# EAGLE design eib-64-large (EAGLE 9.6.2)
DESIGNER: JON NEWMAN; DESIGN_NAME: EIB-64-LARGE; LICENSE: CERN OHL v1.2; REVISION: 1.1
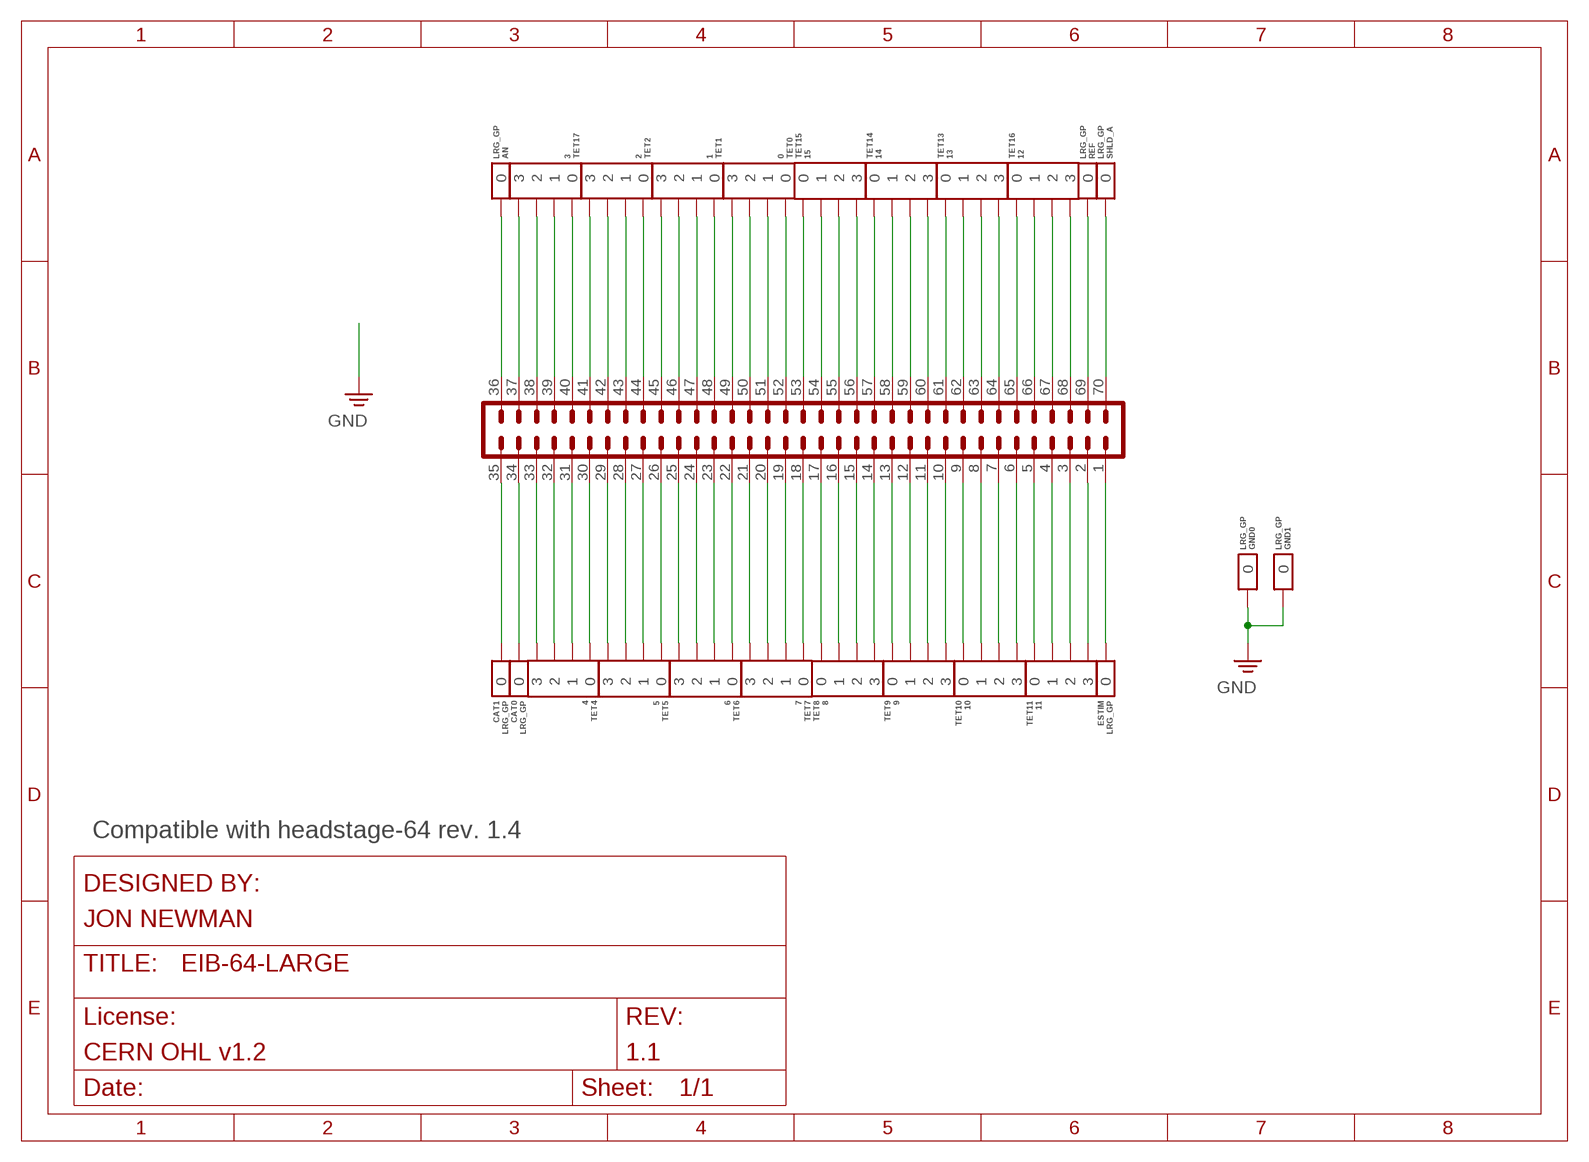
[diagram p0: schematic, sheet 1]

## Parts
AN  LRG_GP  GOLDPIN_0.5ID_0.7OD  [GOLDPIN_0.5ID_0.7OD]
CAT0  LRG_GP  GOLDPIN_0.5ID_0.7OD  [GOLDPIN_0.5ID_0.7OD]
CAT1  LRG_GP  GOLDPIN_0.5ID_0.7OD  [GOLDPIN_0.5ID_0.7OD]
ESTIM  LRG_GP  GOLDPIN_0.5ID_0.7OD  [GOLDPIN_0.5ID_0.7OD]
GND0  LRG_GP  GOLDPIN_0.5ID_0.7OD  [GOLDPIN_0.5ID_0.7OD]
GND1  LRG_GP  GOLDPIN_0.5ID_0.7OD  [GOLDPIN_0.5ID_0.7OD]
J1  DF40-REC  PINHD-2X35_DF40REF-LRG  [DDF40-70REC-LRG]
REF  LRG_GP  GOLDPIN_0.5ID_0.7OD  [GOLDPIN_0.5ID_0.7OD]
SHLD_A  LRG_GP  GOLDPIN_0.5ID_0.7OD  [GOLDPIN_0.5ID_0.7OD]
TET0  0  TETRODE_128_0.5ID_0.7OD  [TETRODE_128_0.5ID_0.7OD]
TET1  1  TETRODE_128_0.5ID_0.7OD  [TETRODE_128_0.5ID_0.7OD]
TET2  2  TETRODE_128_0.5ID_0.7OD  [TETRODE_128_0.5ID_0.7OD]
TET4  4  TETRODE_128_0.5ID_0.7OD  [TETRODE_128_0.5ID_0.7OD]
TET5  5  TETRODE_128_0.5ID_0.7OD  [TETRODE_128_0.5ID_0.7OD]
TET6  6  TETRODE_128_0.5ID_0.7OD  [TETRODE_128_0.5ID_0.7OD]
TET7  7  TETRODE_128_0.5ID_0.7OD  [TETRODE_128_0.5ID_0.7OD]
TET8  8  TETRODE_128_0.5ID_0.7OD  [TETRODE_128_0.5ID_0.7OD]
TET9  9  TETRODE_128_0.5ID_0.7OD  [TETRODE_128_0.5ID_0.7OD]
TET10  10  TETRODE_128_0.5ID_0.7OD  [TETRODE_128_0.5ID_0.7OD]
TET11  11  TETRODE_128_0.5ID_0.7OD  [TETRODE_128_0.5ID_0.7OD]
TET13  13  TETRODE_128_0.5ID_0.7OD  [TETRODE_128_0.5ID_0.7OD]
TET14  14  TETRODE_128_0.5ID_0.7OD  [TETRODE_128_0.5ID_0.7OD]
TET15  15  TETRODE_128_0.5ID_0.7OD  [TETRODE_128_0.5ID_0.7OD]
TET16  12  TETRODE_128_0.5ID_0.7OD  [TETRODE_128_0.5ID_0.7OD]
TET17  3  TETRODE_128_0.5ID_0.7OD  [TETRODE_128_0.5ID_0.7OD]

## Nets
CAT0: CAT0.P$1 J1.34
CAT1: CAT1.P$1 J1.35
ESTIM: ESTIM.P$1 J1.1
GND: GND0.P$1 GND1.P$1
N$1: AN.P$1 J1.36
N$2: J1.69 REF.P$1
N$3: J1.70 SHLD_A.P$1
N$4: J1.51 TET0.1
N$5: J1.52 TET0.0
N$6: J1.50 TET0.2
N$7: J1.49 TET0.3
N$8: J1.47 TET1.1
N$9: J1.48 TET1.0
N$10: J1.46 TET1.2
N$11: J1.45 TET1.3
N$12: J1.43 TET2.1
N$13: J1.44 TET2.0
N$14: J1.42 TET2.2
N$15: J1.41 TET2.3
N$16: J1.62 TET13.1
N$17: J1.61 TET13.0
N$18: J1.63 TET13.2
N$19: J1.64 TET13.3
N$20: J1.58 TET14.1
N$21: J1.57 TET14.0
N$22: J1.59 TET14.2
N$23: J1.60 TET14.3
N$24: J1.54 TET15.1
N$25: J1.53 TET15.0
N$26: J1.55 TET15.2
N$27: J1.56 TET15.3
N$28: J1.66 TET16.1
N$29: J1.65 TET16.0
N$30: J1.67 TET16.2
N$31: J1.68 TET16.3
N$32: J1.39 TET17.1
N$33: J1.5 TET11.0
N$34: J1.4 TET11.1
N$35: J1.3 TET11.2
N$36: J1.2 TET11.3
N$37: J1.40 TET17.0
N$38: J1.38 TET17.2
N$39: J1.37 TET17.3
N$199: J1.33 TET4.3
N$200: J1.32 TET4.2
N$201: J1.31 TET4.1
N$202: J1.30 TET4.0
N$203: J1.29 TET5.3
N$204: J1.28 TET5.2
N$205: J1.27 TET5.1
N$206: J1.26 TET5.0
N$207: J1.25 TET6.3
N$208: J1.24 TET6.2
N$209: J1.23 TET6.1
N$210: J1.22 TET6.0
N$211: J1.21 TET7.3
N$212: J1.20 TET7.2
N$213: J1.19 TET7.1
N$214: J1.18 TET7.0
N$215: J1.17 TET8.0
N$216: J1.16 TET8.1
N$217: J1.15 TET8.2
N$218: J1.14 TET8.3
N$219: J1.13 TET9.0
N$220: J1.12 TET9.1
N$221: J1.11 TET9.2
N$222: J1.10 TET9.3
N$223: J1.9 TET10.0
N$224: J1.8 TET10.1
N$225: J1.7 TET10.2
N$226: J1.6 TET10.3

## Notes on the sheet
- Compatible with headstage-64 rev. 1.4

## Library data of the parts
AN CAT0 CAT1 ESTIM GND0 GND1 REF SHLD_A = jonnew:GOLDPIN
J1 = jonnew:PINHD-2X35
TET0 TET1 TET2 TET4-TET11 TET13-TET17 = jonnew:TETRODE

## Board
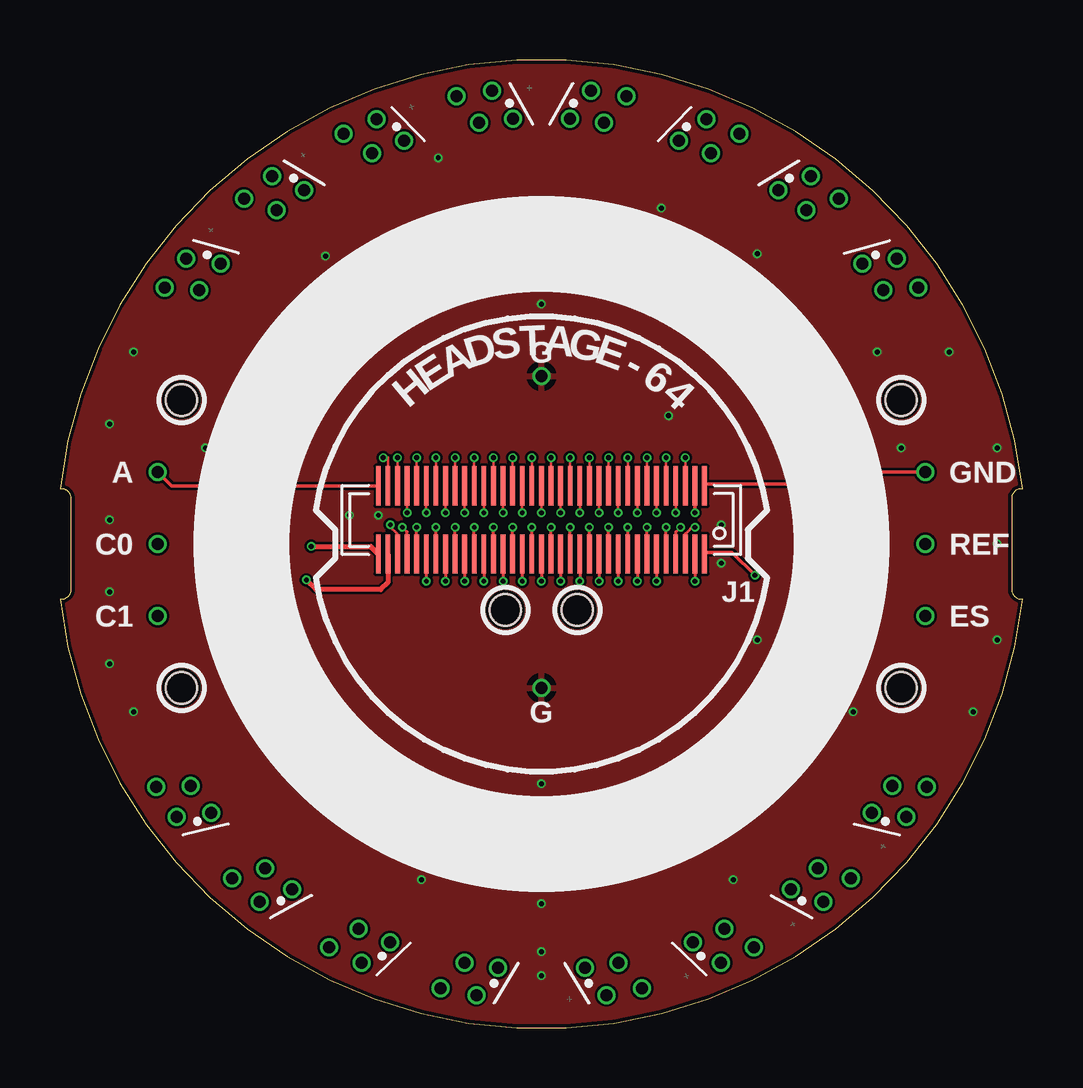
[diagram p1: board, top side]
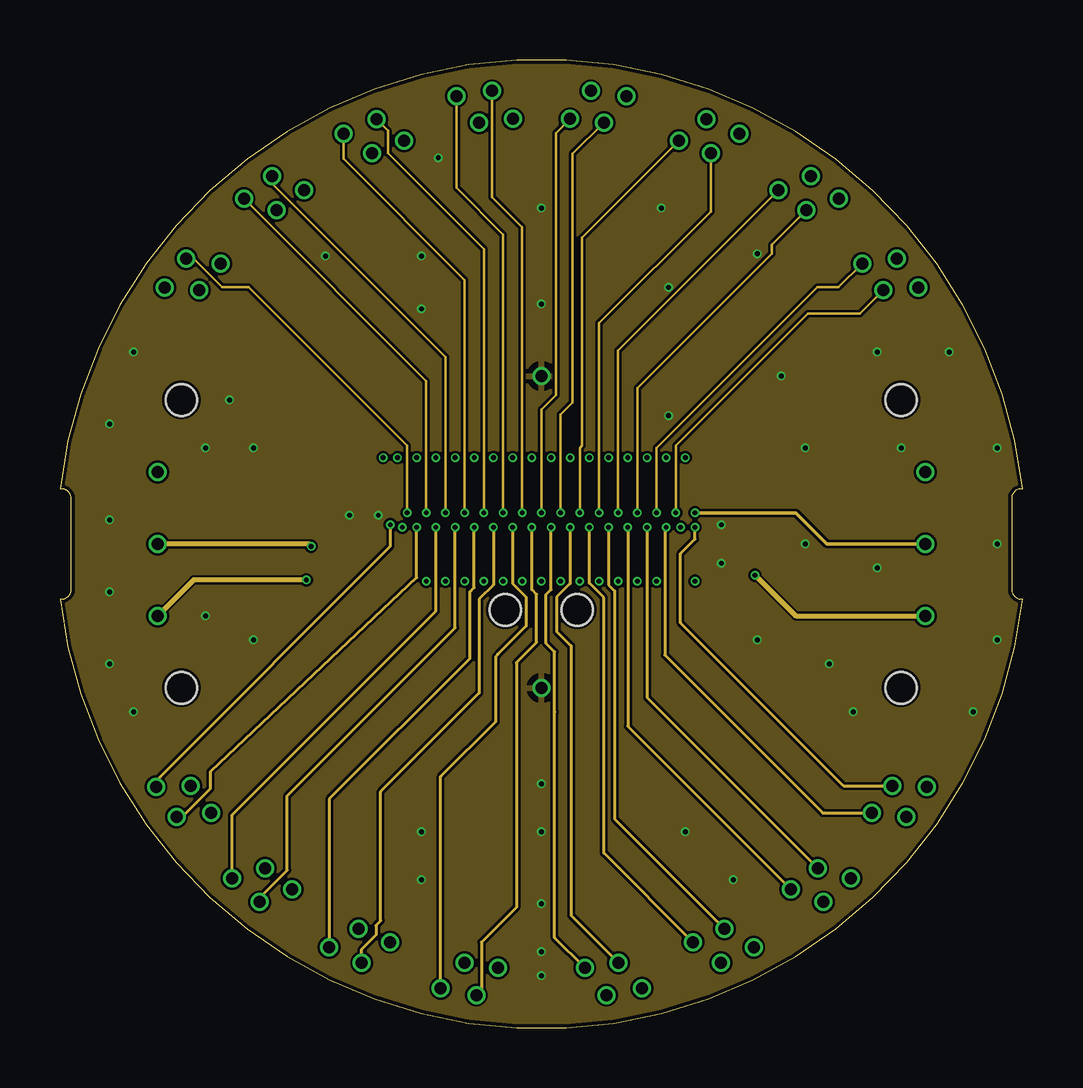
[diagram p2: board, inner layer Route2]
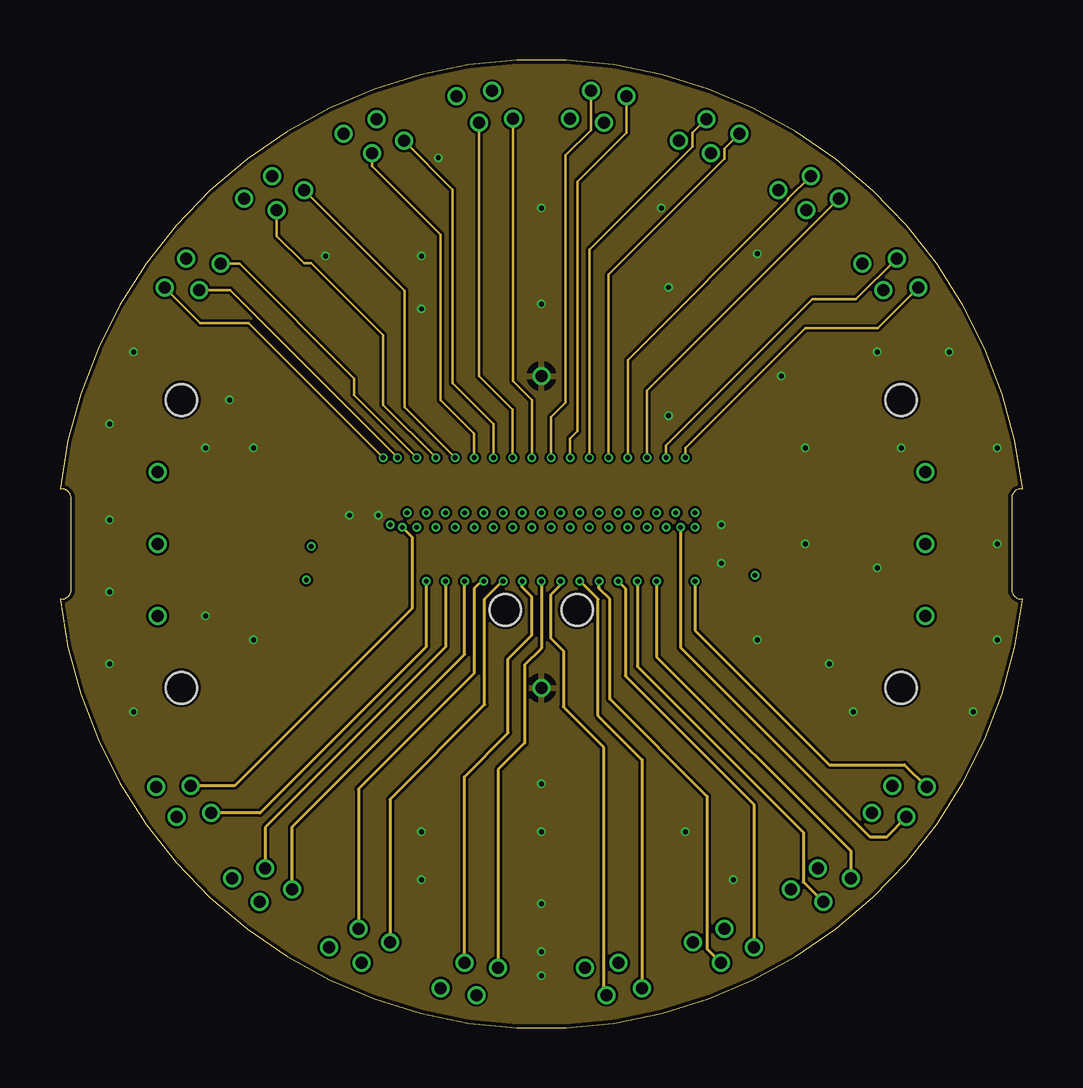
[diagram p3: board, inner layer Route15]
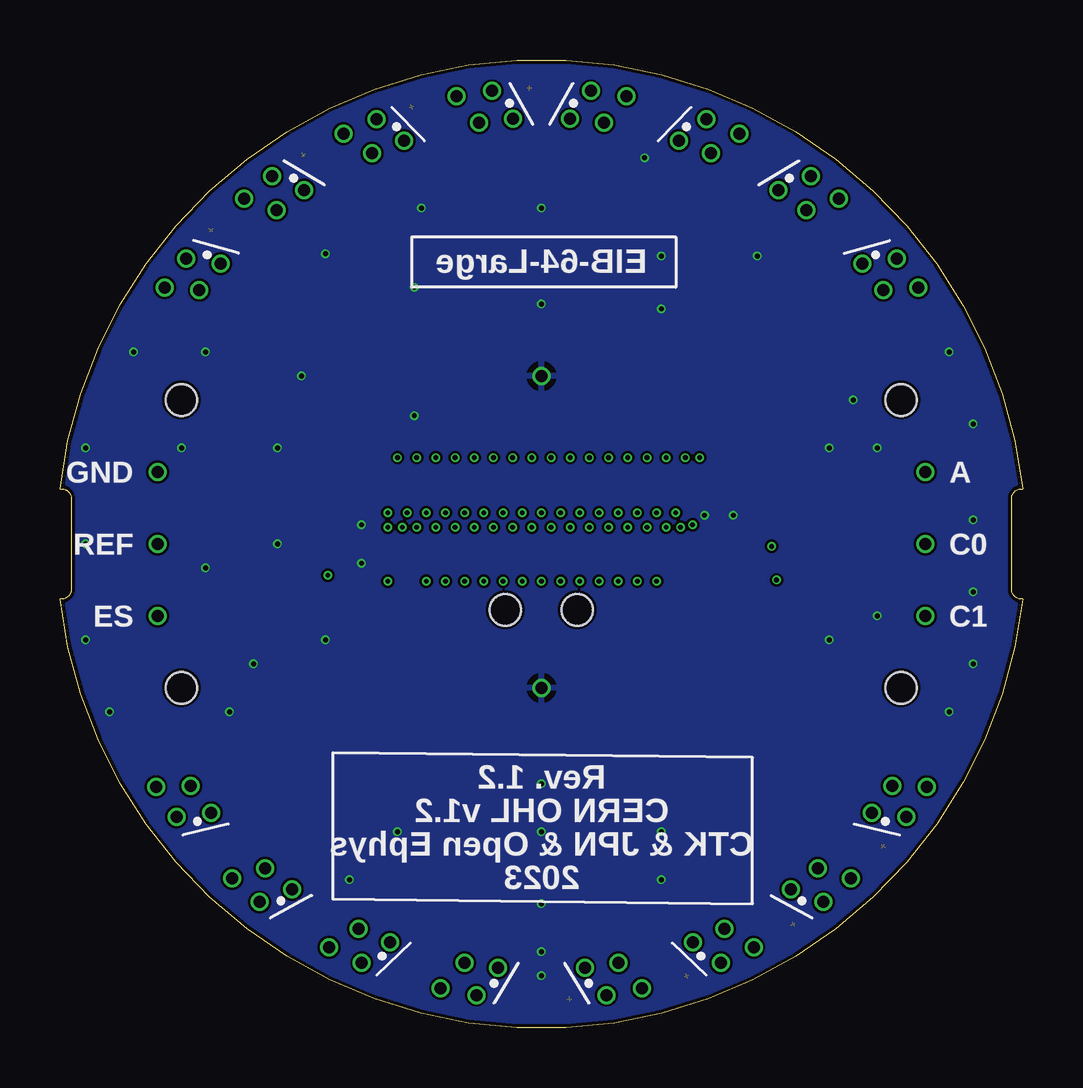
[diagram p4: board, bottom side, seen from below]

Size 40.14 x 40.35 mm. Coordinates in mm from the lower left corner, seen from the top.
Outline: 0,17.88 0.07,17.88 arc90 0.47,18.28 0.47,22.08 arc90 0.07,22.48 0,22.48 arc-167 40.14,22.48 40.07,22.48 arc90 39.67,22.08 39.67,18.28 arc90 40.07,17.88 40.14,17.88 arc-167 0,17.88
Copper layers (1+2*15+16): Top 0.035mm / dielectric 1.5mm / Route2 0.035mm / dielectric 0.15mm / Route15 0.035mm / dielectric 0.2mm / Bottom 0.035mm
Design rules "pcb-cart-standard-4-layer *": minimum track width 3mil, minimum drill 6mil, track to track 4mil, track to pad 4mil, pad to pad 4mil, via to via 4mil, smd to smd 4mil, copper to edge 6mil, drill to drill 6mil, minimum pad ring 3mil, minimum via ring 3mil, stop-mask expansion 2mil, vias tented up to drill 20mil, thermal gap 10mil
Holes 1.3 mm at 18.57,17.43 21.57,17.43 5.07,26.18 5.07,14.18 35.07,14.18 35.07,26.18

### Footprints (pad centres in the part's own frame; a part is rotated, then mirrored left to right if it is on the bottom)
GOLDPIN_0.5ID_0.7OD = drill 0.5 pad 0.7: P$1 0,0
DDF40-70REC-LRG = smd 0.2 x 1.64: 1 -6.8,1.42; 2 -6.4,1.42; 3 -6,1.42; 4 -5.6,1.42; 5 -5.2,1.42; 6 -4.8,1.42; 7 -4.4,1.42; 8 -4,1.42; 9 -3.6,1.42; 10 -3.2,1.42; 11 -2.8,1.42; 12 -2.4,1.42; 13 -2,1.42; 14 -1.6,1.42; 15 -1.2,1.42; 16 -0.8,1.42; 17 -0.4,1.42; 18 0,1.42; 19 0.4,1.42; 20 0.8,1.42; 21 1.2,1.42; 22 1.6,1.42; 23 2,1.42; 24 2.4,1.42; 25 2.8,1.42; 26 3.2,1.42; 27 3.6,1.42; 28 4,1.42; 29 4.4,1.42; 30 4.8,1.42; 31 5.2,1.42; 32 5.6,1.42; 33 6,1.42; 34 6.4,1.42; 35 6.8,1.42; 36 6.8,-1.42; 37 6.4,-1.42; 38 6,-1.42; 39 5.6,-1.42; 40 5.2,-1.42; 41 4.8,-1.42; 42 4.4,-1.42; 43 4,-1.42; 44 3.6,-1.42; 45 3.2,-1.42; 46 2.8,-1.42; 47 2.4,-1.42; 48 2,-1.42; 49 1.6,-1.42; 50 1.2,-1.42; 51 0.8,-1.42; 52 0.4,-1.42; 53 0,-1.42; 54 -0.4,-1.42; 55 -0.8,-1.42; 56 -1.2,-1.42; 57 -1.6,-1.42; 58 -2,-1.42; 59 -2.4,-1.42; 60 -2.8,-1.42; 61 -3.2,-1.42; 62 -3.6,-1.42; 63 -4,-1.42; 64 -4.4,-1.42; 65 -4.8,-1.42; 66 -5.2,-1.42; 67 -5.6,-1.42; 68 -6,-1.42; 69 -6.4,-1.42; 70 -6.8,-1.42
TETRODE_128_0.5ID_0.7OD = drill 0.5 pad 0.703: 0 0.724,17.743; 1 1.562,18.934; 2 2.14,17.628; 3 3.058,18.748

### Placement (x,y rotation side)
AN  4.07,23.18 0 top
CAT0  4.07,17.18 0 top
CAT1  4.07,20.18 0 top
ESTIM  36.07,17.18 0 top
GND0  20.07,27.18 0 top
GND1  20.07,14.18 0 top
J1  20.07,21.18 180 top
REF  36.07,20.18 0 top
SHLD_A  36.07,23.18 0 top
TET0  20.07,20.18 358.5 bottom
TET1  20.07,20.18 343.5 bottom
TET2  20.07,20.18 328.5 bottom
TET4  20.07,20.18 131.5 top
TET5  20.07,20.18 146.5 top
TET6  20.07,20.18 161.5 top
TET7  20.07,20.18 176.5 top
TET8  20.07,20.18 176.5 bottom
TET9  20.07,20.18 161.5 bottom
TET10  20.07,20.18 146.5 bottom
TET11  20.07,20.18 131.5 bottom
TET13  20.07,20.18 328.5 top
TET14  20.07,20.18 343.5 top
TET15  20.07,20.18 358.5 top
TET16  20.07,20.18 313.5 top
TET17  20.07,20.18 313.5 bottom

### Tracks (layer width: path | path; a pad name or v marks a point on that pad's centre or on a via)
CAT0  (via drill 0.2)
  Top 0.2: v10.27,18.68 10.67,18.28 13.37,18.28 13.67,18.58 J1.34
  Route2 0.2: v10.27,18.68 5.57,18.68 CAT0.P$1
CAT1  (via drill 0.2)
  Top 0.2: v10.47,20.08 12.95,20.08 J1.35
  Route2 0.127: v10.47,20.08 10.37,20.18
  Route2 0.2: 10.37,20.18 CAT1.P$1
ESTIM  (via drill 0.2)
  Top 0.15: J1.1 26.94,19.83 28.02,19.83 v28.97,18.88
  Route2 0.2: ESTIM.P$1 30.67,17.18 v28.97,18.88
GND  (via drill 0.2)
  other vias: 27.57,19.38 27.57,20.98 25.37,25.53 2.07,15.18 3.07,13.18 8.07,16.18 2.07,21.18 2.07,25.18 3.07,28.18 8.07,24.18 6.07,24.18 6.07,17.18 32.07,15.18 29.07,16.18 33.07,13.18 34.07,19.18 31.07,20.18 31.07,24.18 35.07,24.18 37.07,28.18 39.07,24.18 39.07,16.18 38.07,13.18 26.07,8.18 20.07,2.18 15.07,6.18 15.07,32.18 20.07,30.18 20.07,34.18 25.07,34.18 25.37,30.88 15.07,29.98 15.77,36.28 11.07,32.18 29.07,32.28 34.07,28.18 30.07,27.18 7.07,26.18 20.07,8.18 20.07,10.18 20.07,3.18 20.07,5.18 15.07,8.18 39.07,20.18 2.07,18.18 28.07,6.18 13.27,21.38 12.07,21.38
  pour Bottom (isolate 0.1): -3.48,42.53 46.52,42.53 46.52,-3.47 -3.48,-3.47
  pour Top (isolate 0.1): -6.48,45.53 49.52,45.53 49.52,-6.47 -6.48,-6.47
  pour Route15 (isolate 0.1): -4.48,43.53 47.52,43.53 47.52,-4.47 -4.48,-4.47
  pour Route2 (isolate 0.1): -5.48,44.53 48.52,44.53 48.52,-5.47 -5.48,-5.47
N$1
  Top 0.152: J1.36 4.65,22.6 AN.P$1
N$2  (via drill 0.2)
  Top 0.152: J1.69 v26.47,21.48
  Route2 0.152: REF.P$1 31.97,20.18 30.67,21.48 v26.47,21.48
N$3
  Top 0.152: J1.70 26.95,22.68 31.07,22.68 31.57,23.18 SHLD_A.P$1
N$4  (via drill 0.2)
  Top 0.102: J1.51 v19.27,21.48
  Route2 0.102: v19.27,21.48 19.27,33.38 18.01,34.63 TET0.1
N$5  (via drill 0.2)
  Top 0.102: J1.52 v19.67,23.78
  Route15 0.102: TET0.0 18.88,26.96 19.67,26.18 v19.67,23.78
N$6  (via drill 0.2)
  Top 0.102: J1.50 v18.87,23.78
  Route15 0.102: TET0.2 17.47,27.18 18.87,25.78 v18.87,23.78
N$7  (via drill 0.2)
  Top 0.102: J1.49 v18.47,21.48
  Route2 0.102: v18.47,21.48 18.47,33.08 16.52,35.02 TET0.3
N$8  (via drill 0.2)
  Top 0.102: J1.47 v17.67,21.48
  Route2 0.102: v17.67,21.48 17.67,32.48 13.67,36.48 13.67,37.41 TET1.1
N$9  (via drill 0.2)
  Top 0.102: J1.48 v18.07,23.78
  Route15 0.102: TET1.0 16.37,34.95 16.37,26.88 18.07,25.18 v18.07,23.78
N$10  (via drill 0.2)
  Top 0.102: J1.46 v17.27,23.78
  Route15 0.102: TET1.2 13.01,35.93 15.87,33.08 15.87,26.18 17.27,24.78 v17.27,23.78
N$11  (via drill 0.2)
  Top 0.102: J1.45 v16.87,21.48
  Route2 0.102: TET1.3 11.81,36.23 16.87,31.18 v16.87,21.48
N$12  (via drill 0.2)
  Top 0.102: J1.43 v16.07,21.48
  Route2 0.102: v16.07,21.48 16.07,27.98 8.84,35.2 TET2.1
N$13  (via drill 0.2)
  Top 0.102: J1.44 v16.47,23.78
  Route15 0.102: v16.47,23.78 14.37,25.88 14.37,30.74 TET2.0
N$14  (via drill 0.2)
  Top 0.102: J1.42 v15.67,23.78
  Route15 0.102: v15.67,23.78 13.47,25.98 13.47,28.88 10.47,31.88 10.17,31.88 9.03,33.01 TET2.2
N$15  (via drill 0.2)
  Top 0.102: J1.41 v15.27,21.48
  Route2 0.102: v15.27,21.48 15.27,26.96 TET2.3
N$16  (via drill 0.2)
  Top 0.102: J1.62 v23.67,23.78
  Route15 0.102: TET13.1 30.35,34.56 30.35,34.52 23.67,27.84 v23.67,23.78
N$17  (via drill 0.2)
  Top 0.102: J1.61 v23.27,21.48
  Route2 0.102: v23.27,21.48 23.27,28.24 TET13.0
N$18  (via drill 0.2)
  Top 0.102: J1.63 v24.07,21.48
  Route2 0.102: TET13.2 29.67,32.65 29.67,32.28 24.07,26.68 v24.07,21.48
N$19  (via drill 0.2)
  Top 0.102: J1.64 v24.47,23.78
  Route15 0.102: TET13.3 24.47,26.56 v24.47,23.78
N$20  (via drill 0.2)
  Top 0.102: J1.58 v22.07,23.78
  Route15 0.102: TET14.1 26.37,37.31 26.37,36.75 22.07,32.45 v22.07,23.78
N$21  (via drill 0.2)
  Top 0.102: J1.57 v21.67,21.48
  Route2 0.102: v21.67,21.48 21.67,24.18 21.77,24.28 21.77,32.95 TET14.0
N$22  (via drill 0.2)
  Top 0.102: J1.59 v22.47,21.48
  Route2 0.102: v22.47,21.48 22.47,29.38 27.13,34.03 TET14.2
N$23  (via drill 0.2)
  Top 0.102: J1.60 v22.87,23.78
  Route15 0.102: TET14.3 27.7,36.65 27.7,36.23 22.87,31.41 v22.87,23.78
N$24  (via drill 0.2)
  Top 0.102: J1.54 v20.47,23.78
  Route15 0.102: v20.47,23.78 20.47,25.48 21.07,26.08 21.07,36.38 22.13,37.43 TET15.1
N$25  (via drill 0.2)
  Top 0.102: J1.53 v20.07,21.48
  Route2 0.102: v20.07,21.48 20.07,25.78 20.67,26.38 20.67,37.31 TET15.0
N$26  (via drill 0.2)
  Top 0.102: J1.55 v20.87,21.48
  Route2 0.102: v20.87,21.48 20.87,25.58 21.37,26.08 21.37,36.44 TET15.2
N$27  (via drill 0.2)
  Top 0.102: J1.56 v21.27,23.78
  Route15 0.102: TET15.3 23.62,37.32 21.57,35.28 21.57,24.88 21.27,24.58 v21.27,23.78
N$28  (via drill 0.2)
  Top 0.102: J1.66 v25.27,23.78
  Route15 0.102: v25.27,23.78 25.27,24.28 31.37,30.38 33.18,30.38 TET16.1
N$29  (via drill 0.2)
  Top 0.102: J1.65 v24.87,21.48
  Route2 0.102: v24.87,21.48 24.87,24.18 31.57,30.88 32.45,30.88 TET16.0
N$30  (via drill 0.2)
  Top 0.102: J1.67 v25.67,21.48
  Route2 0.102: v25.67,21.48 25.67,24.28 31.17,29.78 33.35,29.78 TET16.2
N$31  (via drill 0.2)
  Top 0.102: J1.68 v26.07,23.78
  Route15 0.102: v26.07,23.78 26.07,24.18 31.07,29.18 34.09,29.18 TET16.3
N$32  (via drill 0.2)
  Top 0.102: J1.39 v14.47,21.48
  Route2 0.102: v14.47,21.48 14.47,24.28 7.87,30.88 6.77,30.88 5.57,32.08 TET17.1
N$33  (via drill 0.2)
  Top 0.127: J1.5 v25.27,20.88
  Route2 0.127: v25.27,20.88 25.21,20.82 25.21,15.55 31.8,8.96 TET11.0
N$34  (via drill 0.2)
  Top 0.127: J1.4 25.67,20.68 v25.87,20.88
  Route15 0.127: TET11.1 34.47,7.98 33.75,7.98 25.87,15.86 v25.87,20.88
N$35  (via drill 0.2)
  Top 0.127: J1.3 26.07,20.59 26.16,20.68 26.35,20.88 v26.47,20.88
  Route2 0.127: v26.47,20.88 26.47,20.38 25.87,19.78 25.87,16.89 32.66,10.1 TET11.2
N$36  (via drill 0.2)
  Top 0.127: J1.2 v26.47,18.63
  Route15 0.127: TET11.3 35.2,10.98 32.07,10.98 26.47,16.57 v26.47,18.63
N$37  (via drill 0.2)
  Top 0.102: J1.40 v14.87,23.78
  Route15 0.102: v14.87,23.78 12.27,26.38 12.27,27.08 7.48,31.86 TET17.0
N$38  (via drill 0.2)
  Top 0.102: J1.38 v14.07,23.78
  Route15 0.102: v14.07,23.78 7.09,30.76 TET17.2
N$39  (via drill 0.2)
  Top 0.102: J1.37 13.67,23.78 v13.47,23.78
  Route15 0.102: v13.47,23.78 7.87,29.38 5.85,29.38 TET17.3
N$199  (via drill 0.2)
  Top 0.127: J1.33 14.07,20.59 13.77,20.89 v13.77,20.98
  Route2 0.127: v13.77,20.98 13.77,20.08 4,10.31 TET4.3
N$200  (via drill 0.2)
  Top 0.127: J1.32 14.47,20.68 v14.27,20.88
  Route15 0.127: v14.27,20.88 14.67,20.48 14.67,17.49 7.28,10.1 TET4.2
N$201  (via drill 0.2)
  Top 0.127: J1.31 v14.87,20.88
  Route2 0.127: v14.87,20.88 14.87,18.78 6.27,10.68 6.27,9.98 5.09,8.8 TET4.1 | v14.87,20.88
N$202  (via drill 0.2)
  Top 0.127: J1.30 v15.27,18.63
  Route15 0.127: TET4.0 8.34,8.96 15.27,15.89 v15.27,18.63
N$203  (via drill 0.2)
  Top 0.127: J1.29 v15.67,20.88
  Route2 0.127: v15.67,20.88 15.67,17.37 7.17,8.88 TET5.3
N$204  (via drill 0.2)
  Top 0.127: J1.28 v16.07,18.63
  Route15 0.127: v16.07,18.63 16.07,15.88 8.56,8.36 TET5.2
N$205  (via drill 0.2)
  Top 0.127: J1.27 v16.47,20.88
  Route2 0.127: v16.47,20.88 16.47,16.68 9.47,9.68 9.47,6.58 8.32,5.42 TET5.1
N$206  (via drill 0.2)
  Top 0.127: J1.26 v16.87,18.63
  Route15 0.127: v16.87,18.63 16.87,15.58 9.67,8.38 TET5.0
N$207  (via drill 0.2)
  Top 0.127: J1.25 v17.27,20.88
  Route2 0.127: TET6.3 11.22,9.54 17.09,15.41 17.09,18.18 17.27,18.36 v17.27,20.88
N$208  (via drill 0.2)
  Top 0.127: J1.24 v17.67,18.63
  Route15 0.127: v17.67,18.63 17.67,18.73 17.27,18.32 17.27,14.78 12.45,9.96 TET6.2
N$209  (via drill 0.2)
  Top 0.127: J1.23 v18.07,20.88
  Route2 0.127: v18.07,20.88 18.07,18.48 17.47,17.88 17.47,13.96 13.37,9.86 13.37,4.48 13.17,4.28 13.17,3.88 12.58,3.29 TET6.1
N$210  (via drill 0.2)
  Top 0.127: J1.22 v18.47,18.63
  Route15 0.127: TET6.0 13.75,9.53 17.7,13.48 17.7,17.88 18.45,18.63 v18.47,18.63
N$211  (via drill 0.2)
  Top 0.127: J1.21 v18.87,20.88
  Route2 0.127: v18.87,20.88 18.87,18.53 19.44,17.96 19.44,16.75 18.26,15.58 18.22,15.53 18.17,15.49 18.17,12.78 15.87,10.48 TET7.3
N$212  (via drill 0.2)
  Top 0.127: J1.20 v19.27,18.63
  Route15 0.127: TET7.2 16.86,10.48 18.69,12.3 18.69,15.39 19.67,16.38 19.67,17.98 19.27,18.38 v19.27,18.63
N$213  (via drill 0.2)
  Top 0.127: J1.19 v19.67,20.88
  Route2 0.127: TET7.1 17.57,1.59 17.57,3.58 19.02,5.03 19.02,15.23 19.87,16.08 19.87,18.08 19.67,18.28 v19.67,20.88
N$214  (via drill 0.2)
  Top 0.127: J1.18 v20.07,18.63
  Route15 0.127: v20.07,18.63 20.07,15.83 19.37,15.13 19.37,11.88 18.26,10.77 TET7.0
N$215  (via drill 0.2)
  Top 0.127: J1.17 v20.47,20.88
  Route2 0.127: TET8.0 20.62,3.77 20.62,13.17 20.62,13.18 20.62,15.68 20.27,16.03 20.27,18.08 20.47,18.28 v20.47,20.88
N$216  (via drill 0.2)
  Top 0.127: J1.16 v20.87,18.63
  Route15 0.127: TET8.1 22.67,1.49 22.67,11.69 20.98,13.39 20.98,15.73 20.47,16.24 20.47,18.08 20.87,18.48 v20.87,18.63
N$217  (via drill 0.2)
  Top 0.127: J1.15 v21.27,20.88
  Route2 0.127: v21.27,20.88 21.27,18.53 20.7,17.96 20.7,16.53 21.3,15.93 21.3,4.69 TET8.2
N$218  (via drill 0.2)
  Top 0.127: J1.14 v21.67,18.63
  Route15 0.127: v21.67,18.63 21.67,18.58 21.74,18.58 22.44,17.88 22.44,13.01 24.27,11.18 TET8.3
N$219  (via drill 0.2)
  Top 0.127: J1.13 v22.07,20.88
  Route2 0.127: TET9.0 22.67,7.3 22.67,17.94 22.07,18.54 v22.07,20.88
N$220  (via drill 0.2)
  Top 0.127: J1.12 v22.47,18.63
  Route15 0.127: TET9.1 26.97,3.3 26.97,9.66 22.92,13.71 22.92,17.88 22.47,18.33 v22.47,18.63
N$221  (via drill 0.2)
  Top 0.127: J1.11 v22.87,20.88
  Route2 0.127: v22.87,20.88 22.87,18.48 23.12,18.23 23.12,8.71 TET9.2
N$222  (via drill 0.2)
  Top 0.127: J1.10 v23.27,18.63
  Route15 0.127: TET9.3 28.92,9.33 23.57,14.68 23.57,18.33 v23.27,18.63
N$223  (via drill 0.2)
  Top 0.127: J1.9 v23.67,20.88
  Route2 0.127: v23.67,20.88 23.67,12.58 TET10.0
N$224  (via drill 0.2)
  Top 0.127: J1.8 v24.07,18.63
  Route15 0.127: v24.07,18.63 24.07,15.07 30.98,8.16 30.98,6.09 TET10.1
N$225  (via drill 0.2)
  Top 0.127: J1.7 v24.47,20.88
  Route2 0.127: v24.47,20.88 24.47,13.77 TET10.2
N$226  (via drill 0.2)
  Top 0.127: J1.6 v24.87,18.63
  Route15 0.127: TET10.3 32.97,7.38 24.87,15.48 v24.87,18.63

### Text on the board
tPlace: A | D | S | T | G | A | G | E | - | H | E | 6 | 4 | A | GND | C0 | REF | C1 | ES | G
bPlace: EIB-64-Large | A | GND | C0 | REF | C1 | ES | Rev. 1.2 / CERN OHL v1.2 / CTK & JPN & Open Ephys / 2023